# Altium schematic sheet Power.SchDoc: Power Supplies, Battery Charger & Switch
size A2; Revision: 1.0; SheetNumber: 4; SheetTotal: 5; ENG_APP_DATE: --/--/--; DSN_APP_DATE: --/--/--; CHK_APP_DATE: --/--/--
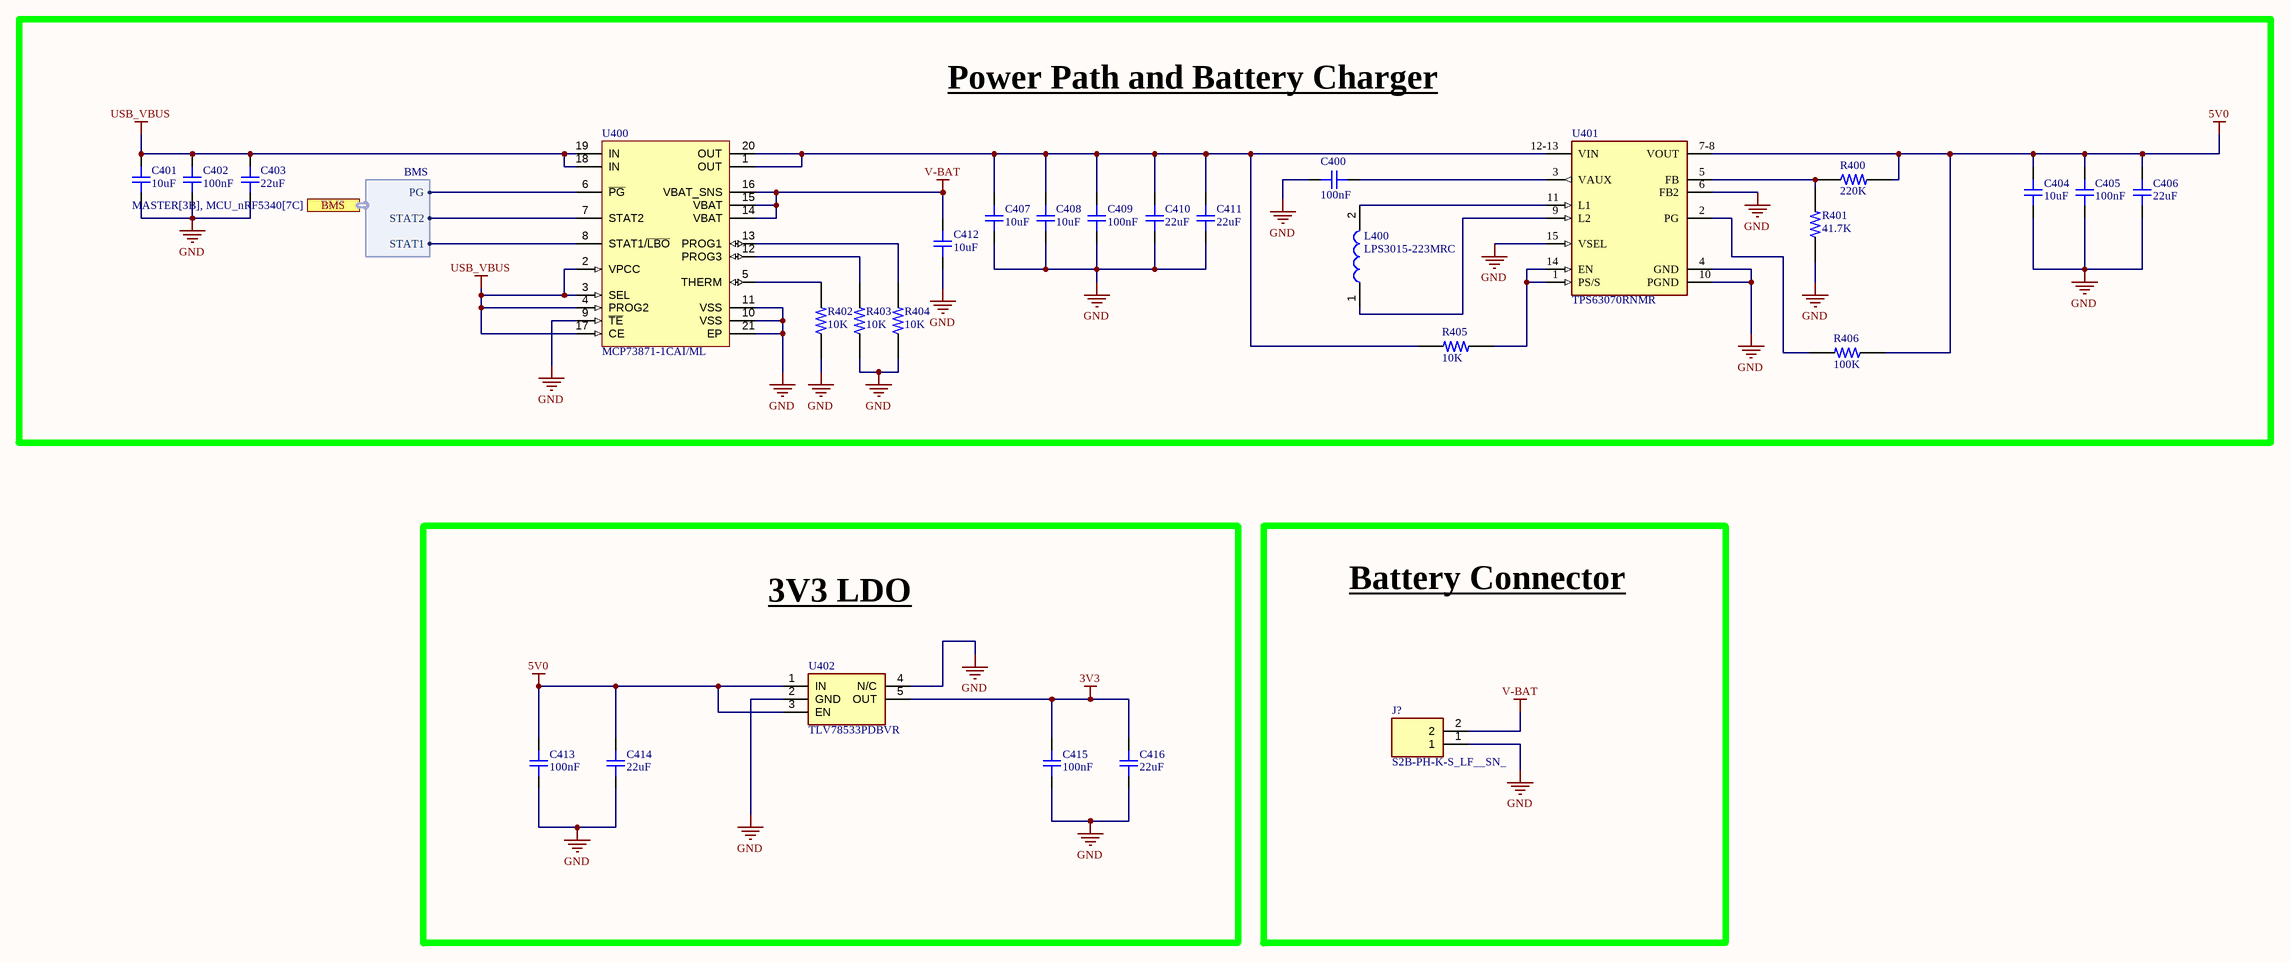
[diagram p0: Power.SchDoc]

## Parts
C400  100nF  [CAP_0603]
C401  10uF  [CAP_0603]
C402  100nF  [CAP_0603]
C403  22uF  [CAP_0603]
C404  10uF  [CAP_0603]
C405  100nF  [CAP_0603]
C406  22uF  [CAP_0603]
C407  10uF  [CAP_0603]
C408  10uF  [CAP_0603]
C409  100nF  [CAP_0603]
C410  22uF  [CAP_0603]
C411  22uF  [CAP_0603]
C412  10uF  [CAP_0603]
C413  100nF  [CAP_0603]
C414  22uF  [CAP_0603]
C415  100nF  [CAP_0603]
C416  22uF  [CAP_0603]
J?  S2B-PH-K-S_LF__SN_  [SHDRRA2W50P0X200_1X2_590X760X480P]
L400  LPS3015-223MRC  [FP-LPS3015-MFG]
R400  220K  [RESC1607X60N]
R401  41.7K  [RESC1607X60N]
R402  10K  [RESC1607X60N]
R403  10K  [RESC1607X60N]
R404  10K  [RESC1607X60N]
R405  10K  [RESC1607X60N]
R406  100K  [RESC1607X60N]
U400  MCP73871-1CAI/ML  [QFN-ML20_M]
U401  TPS63070RNMR  [FP-RNM0015A-MFG]
U402  TLV78533PDBVR  [SOT-23-5]

## Blocks framed on the sheet
Power Path and Battery Charger: C400-C412 L400 R400-R406 U400 U401
3V3 LDO: C413-C416 U402
Battery Connector: J?

## Ports
BMS (harness BMS, see MASTER[3B], MCU_nRF5340[7C])

## Harnesses
BMS: PG, STAT1, STAT2

## Nets
3V3: C415.2 C416.2 U402.5(OUT)
5V0: C404.2 C405.2 C406.2 C413.2 C414.2 R400.2 R406.1 U401.7-8(VOUT) U402.1(IN) U402.3(EN)
GND: C400.2 C401.1 C402.1 C403.1 C404.1 C405.1 C406.1 C407.1 C408.1 C409.1 C410.1 C411.1 C412.1 C413.1 C414.1 C415.1 C416.1 J?.1 R401.1 R402.1 R403.1 R404.1 U400.9(~{TE}) U400.10(VSS) U400.11(VSS) U400.21(EP) U401.4(GND) U401.6(FB2) U401.10(PGND) U401.15(VSEL) U402.2(GND) U402.4(N/C)
USB_VBUS: C401.2 C402.2 C403.2 U400.2(VPCC) U400.3(SEL) U400.4(PROG2) U400.17(CE) U400.18(IN) U400.19(IN)
V-BAT: C412.2 J?.2 U400.14(VBAT) U400.15(VBAT) U400.16(VBAT_SNS)
NetC400_1: C400.1 U401.3(VAUX)
NetC407_2: C407.2 C408.2 C409.2 C410.2 C411.2 R405.2 U400.1(OUT) U400.20(OUT) U401.12-13(VIN)
NetL400_1: L400.1 U401.9(L2)
NetL400_2: L400.2 U401.11(L1)
NetR400_1: R400.1 R401.2 U401.5(FB)
NetR402_2: R402.2 U400.5(THERM)
NetR403_2: R403.2 U400.12(PROG3)
NetR404_2: R404.2 U400.13(PROG1)
NetR405_1: R405.1 U401.1(PS/S) U401.14(EN)
NetR406_2: R406.2 U401.2(PG)
NetU400_6: U400.6(~{PG}) ; port BMS.PG
NetU400_7: U400.7(STAT2) ; port BMS.STAT2
NetU400_8: U400.8(STAT1/~{LBO}) ; port BMS.STAT1

## Notes on the sheet
- DWG. NO.
- REV.
- SHT.
- THIS DOCUMENT AND THE DATA DISCLOSED HEREIN OR HEREWITH IS THE PROPERTY OF ALTIUM LIMITED AND MAY BE FREELY DISTRIBUTED IN WHOLE. NO RIGHTS ARE RESERVED OR EXPRESS OR IMPLIED WARANTEE GIVEN.
- REVISION
- DESCRIPTION
- DATE
- APPROVED
- ENG:
- APPROVALS
- PROJECT
- DSN:
- CHK:
- REFERENCE DOCUMENTS
- PROJECT REVISION:
- TITLE
- DOCUMENT REVISION:
- DESIGN ITEM:
- BOM:
- FAB DWG:
- PCB DWG:
- ASSY DWG:
- SCALE:
- SIZE
- B
- CAGE CODE
- FILE NAME
- DWG NO.
- SHEET
- OF
- REV

## Library data of the parts
C400 C402 C405 C409 C413 C415 = CAP_0603: Multilayer Ceramic Capacitors MLCC, 0.1 uF, 10 %, 0603, 50V, X7R, TR; Manufacturer: *; Manufacturer Part Number: *; Distributor Link: *; LCSC: *; Rating: *; Dielectric: *; Supplier: Future Electronics; Supplier Part Number: 2183445; RoHS: Compliant; Category: Ceramic Capacitors; Stock: 3000; Pricing: 3000=0.0115, 9000=0.0112, 30000=0.0109, 60000=0.0108, 120000=0.0105 (USD); Value: 100nF; Dielectric Material: Ceramic; Lifecycle Status: Production; Max Operating Temperature: 125°C; Min Operating Temperature: -55°C; Mounting Technology: Surface Mount; Number of Terminals: 2; REACH SVHC: Yes; Voltage Rating (DC): 50V; ComponentLink1URL: https://datasheet.octopart.com:443/MAJCU168BB7104KTEA01-Taiyo-Yuden-datasheet-182113548.pdf?src-supplier=IHS; ComponentLink1Description: https://datasheet.octopart.com:443/MAJCU168BB7104KTEA01-Taiyo-Yuden-datasheet-182113548.pdf?src-supplier=IHS
C401 C404 C407 C408 C412 = CAP_0603: Ceramic Capacitor, Multilayer, Ceramic, 4V, 20% +Tol, 20% -Tol, X6S, 22% TC, 10uF, Surface Mount, 1608M/0603; Value: 10µF; Manufacturer: *; Manufacturer Part Number: *; Distributor Link: *; LCSC: *; Rating: *; Dielectric: *; Supplier: Mouser; Supplier Part Number: 81-GXT188C80G106ME3D; RoHS: Compliant; Category: Ceramic Capacitors; Stock: 3027; Pricing: 1=0.31, 10=0.202, 50=0.202, 100=0.115, 1000=0.082, 10000=0.063 (USD); Case/Package: 0603; Dielectric Material: Ceramic; Height: 800µm; Length: 1.6mm; Lifecycle Status: Production; Material: Ceramic; Max Operating Temperature: 105°C; Min Operating Temperature: -55°C; Mounting Technology: Surface Mount; Number of Terminals: 2; REACH SVHC: Yes; Tolerance: 20%; Voltage Rating: 4V; Voltage Rating (DC): 4V; Width: 800µm; ComponentLink1URL: http://sigma.octopart.com:80/reach_statement/Murata-company-16.pdf?src-supplier=Compliance+Statements; ComponentLink1Description: http://sigma.octopart.com:80/reach_statement/Murata-company-16.pdf?src-supplier=Compliance+Statements
C403 C406 C410 C411 C414 C416 = CAP_0603: Ceramic Capacitor, Multilayer, Ceramic, 6.3V, 20% +Tol, 20% -Tol, X6S, 22uF, Surface Mount, 1608M/0603; Value: 22µF; Manufacturer: *; Manufacturer Part Number: *; Distributor Link: *; LCSC: *; Rating: *; Dielectric: *; Supplier: Mouser; Supplier Part Number: 81-GRM188C80J226ME1D; RoHS: Compliant; Category: Ceramic Capacitors; Stock: 5675; Pricing: 1=0.3, 1=0.258, 10=0.195, 10=0.168, 50=0.195, 100=0.112, 100=0.096, 500=0.077, 1000=0.082, 1000=0.071, 2000=0.065, 4000=0.057, 8000=0.053, 10000=0.062, 24000=0.052 (USD); Case/Package: 0603; Dielectric Material: Ceramic; Height: 800µm; Length: 1.6mm; Lifecycle Status: Production; Material: Ceramic; Max Operating Temperature: 105°C; Min Operating Temperature: -55°C; Mounting Technology: Surface Mount; Number of Terminals: 2; REACH SVHC: Yes; Thickness: 800µm; Tolerance: 20%; Voltage Rating: 6.3V; Voltage Rating (DC): 6.3V; Width: 800µm; ComponentLink1URL: https://datasheet.octopart.com:443/GRM188C80J226ME01D-Murata-datasheet-165579666.pdf?src-supplier=TME; ComponentLink1Description: https://datasheet.octopart.com:443/GRM188C80J226ME01D-Murata-datasheet-165579666.pdf?src-supplier=TME; ComponentLink2URL: https://datasheet.octopart.com/GRM188C80J226ME01D-Murata-datasheet-12515295.pdf; ComponentLink2Description: https://datasheet.octopart.com/GRM188C80J226ME01D-Murata-datasheet-12515295.pdf; ComponentLink3URL: https://datasheet.octopart.com/GRM188C80J226ME01D-Murata-datasheet-12510076.pdf; ComponentLink3Description: https://datasheet.octopart.com/GRM188C80J226ME01D-Murata-datasheet-12510076.pdf; ComponentLink4URL: https://datasheet.octopart.com/GRM188C80J226ME01D-Murata-datasheet-11978611.pdf; ComponentLink4Description: https://datasheet.octopart.com/GRM188C80J226ME01D-Murata-datasheet-11978611.pdf; ComponentLink5URL: https://datasheet.octopart.com/GRM188C80J226ME01D-Murata-datasheet-10025737.pdf; ComponentLink5Description: https://datasheet.octopart.com/GRM188C80J226ME01D-Murata-datasheet-10025737.pdf; ComponentLink6URL: https://datasheet.octopart.com/GRM188C80J226ME01D-Murata-datasheet-8819587.pdf; ComponentLink6Description: https://datasheet.octopart.com/GRM188C80J226ME01D-Murata-datasheet-8819587.pdf; ComponentLink7URL: http://sigma.octopart.com:80/reach_statement/Murata-company-16.pdf?src-supplier=Compliance+Statements; ComponentLink7Description: http://sigma.octopart.com:80/reach_statement/Murata-company-16.pdf?src-supplier=Compliance+Statements
J? = S2B-PH-K-S_LF__SN_: PH-2.0mm Header side entry 2 way JST PH Series, Series Number S2B, 2mm Pitch 2 Way 1 Row Right Angle PCB Header, Through Hole Termination, 2A; Manufacturer_Name: JST (JAPAN SOLDERLESS TERMINALS); Manufacturer_Part_Number: S2B-PH-K-S(LF)(SN); Geometry.Height: 4.8mm; Mouser Part Number: 306-S2BPHKSLFSNPP; Mouser Price/Stock: https://www.mouser.co.uk/ProductDetail/JST-Commercial/S2B-PH-K-SLFSN?qs=cdbOS8ANM9A5Ie4gXeMjTA%3D%3D; Datasheet Link: *
L400 = LPS3015-223MRC: Inductor; Manufacturer_Name: COILCRAFT; Datasheet Link: https://www.digikey.com/en/products/detail/coilcraft/LPS3015-223MRC/12714657; Height: 1.5mm; Manufacturer_Part_Number: LPS3015-223MRC; Mouser Part Number: 994-LPS3015-223MRC; Mouser Price/Stock: https://www.mouser.co.uk/ProductDetail/Coilcraft/LPS3015-223MRC?qs=QQJxVsr8EGYLL9xIR9QoZA%3D%3D
R400 = RC0603JR0710KL: Res Thick Film 0603 220K Ohm 1% 1/10W ±100ppm/°C Molded SMD SMD Paper Tape on Plastic Reel; Manufacturer: Bourns; Manufacturer Part Number: CR0603-FX-2203ELF; MF: Yageo; Max Power Dissipation: 100mW; Voltage Rating: 75V; Voltage Rating (DC): 50V; SnapEDA_Link: https://www.snapeda.com/parts/RC0603JR0710KL/Yageo/view-part/?ref=snap; Package: 0603 Yageo; Value: *; MP: RC0603JR0710KL; Check_prices: https://www.snapeda.com/parts/RC0603JR0710KL/Yageo/view-part/?ref=eda; Supplier: RS; Supplier Part Number: 458582; RoHS: Compliant; Category: Chip SMD Resistors; Stock: 14800; Pricing: 10=0.004 (EUR); Case/Package: 0603; Case Code (Imperial): 0603; Case Code (Metric): 1608; China RoHS: Non-Compliant; Composition: Thick Film; Contact Plating: Tin; Features: Moisture Resistant; Height: 450µm; Length: 1.6002mm; Lifecycle Status: Production; Max Operating Temperature: 155°C; Min Operating Temperature: -55°C; Mounting Technology: Surface Mount; Number of Terminals: 2; Number of Terminations: 2; Power Dissipation: 100mW; Power Rating: 100mW; Radiation Hardening: No; REACH SVHC: Yes; Schedule B: 8533210045, 8533210045|8533210045, 8533210045|8533210045|8533210045, 8533210045|8533210045|8533210045|8533210045; Temperature Coefficient: 100ppm/°C; Termination: SMD/SMT; Tolerance: 1%; Width: 800µm; Working Voltage: 75V; ComponentLink1URL: https://datasheet.octopart.com:443/CR0603-FX-2203ELF-Bourns-datasheet-159578630.pdf?src-supplier=ODG+(Origin+Data+Global); ComponentLink1Description: https://datasheet.octopart.com:443/CR0603-FX-2203ELF-Bourns-datasheet-159578630.pdf?src-supplier=ODG+(Origin+Data+Global); ComponentLink2URL: https://datasheet.octopart.com:443/CR0603-FX-2203ELF-Bourns-datasheet-181955239.pdf?src-supplier=IHS; ComponentLink2Description: https://datasheet.octopart.com:443/CR0603-FX-2203ELF-Bourns-datasheet-181955239.pdf?src-supplier=IHS; ComponentLink3URL: https://datasheet.octopart.com:443/CR0603-FX-2203ELF-Bourns-datasheet-68301634.pdf?src-supplier=Burklin+Elektronik; ComponentLink3Description: https://datasheet.octopart.com:443/CR0603-FX-2203ELF-Bourns-datasheet-68301634.pdf?src-supplier=Burklin+Elektronik; ComponentLink4URL: https://datasheet.octopart.com:443/CR0603-FX-2203ELF-Bourns-datasheet-49799764.pdf?src-supplier=Newark; ComponentLink4Description: https://datasheet.octopart.com:443/CR0603-FX-2203ELF-Bourns-datasheet-49799764.pdf?src-supplier=Newark; ComponentLink5URL: https://datasheet.octopart.com:443/CR0603-FX-2203ELF-Bourns-datasheet-154729663.pdf?src-supplier=Electro+Sonic; ComponentLink5Description: https://datasheet.octopart.com:443/CR0603-FX-2203ELF-Bourns-datasheet-154729663.pdf?src-supplier=Electro+Sonic; ComponentLink6URL: https://datasheet.octopart.com/CR0603-FX-2203ELF-Bourns-datasheet-5318152.pdf; ComponentLink6Description: https://datasheet.octopart.com/CR0603-FX-2203ELF-Bourns-datasheet-5318152.pdf; ComponentLink7URL: https://datasheet.octopart.com:443/CR0603-FX-2203ELF-Bourns-datasheet-137066215.pdf?src-supplier=X-ON; ComponentLink7Description: https://datasheet.octopart.com:443/CR0603-FX-2203ELF-Bourns-datasheet-137066215.pdf?src-supplier=X-ON; ComponentLink8URL: https://datasheet.octopart.com:443/CR0603-FX-2203ELF-Bourns-datasheet-140567134.pdf?src-supplier=Arrow.cn; ComponentLink8Description: https://datasheet.octopart.com:443/CR0603-FX-2203ELF-Bourns-datasheet-140567134.pdf?src-supplier=Arrow.cn; ComponentLink9URL: http://sigma.octopart.com:80/conflict_mineral_statement/Bourns-company-36.pdf?src-supplier=Compliance+Statements; ComponentLink9Description: http://sigma.octopart.com:80/conflict_mineral_statement/Bourns-company-36.pdf?src-supplier=Compliance+Statements
R401 = RC0603JR0710KL: Res Thin Film 0402 41.7K Ohm 0.1% 1/16W 25ppm/C Molded SMD SMD Paper T/R; Manufacturer: Vishay; Manufacturer Part Number: TNPW040241K7BEED; MF: Yageo; Max Power Dissipation: 63mW; Temperature Coefficient: 25ppm/°C; Working Voltage: 50V; SnapEDA_Link: https://www.snapeda.com/parts/RC0603JR0710KL/Yageo/view-part/?ref=snap; Package: 0603 Yageo; Value: *; MP: RC0603JR0710KL; Check_prices: https://www.snapeda.com/parts/RC0603JR0710KL/Yageo/view-part/?ref=eda; Supplier: Farnell; Supplier Part Number: 3975618RL; RoHS: Compliant; Category: Chip SMD Resistors; Stock: 4910; Pricing: 100=0.15, 500=0.128, 2500=0.127, 5000=0.118, 10000=0.0988 (EUR); Case/Package: 0402; China RoHS: Compliant; Composition: Thin Film; Contact Plating: Tin; Features: Anti-Sulfur, Automotive AEC-Q200, Moisture Resistant; Height: 350µm; Length: 990.6µm; Lifecycle Status: Production; Max Operating Temperature: 125°C; Min Operating Temperature: -55°C; Mounting Technology: Surface Mount; Number of Terminals: 2; Number of Terminations: 2; Power Dissipation: 63mW; Power Rating: 63mW; REACH SVHC: Yes; Tolerance: 0.1%; Width: 500µm; ComponentLink1URL: https://datasheet.octopart.com:443/TNPW040241K7BEED-Vishay-datasheet-182188515.pdf?src-supplier=IHS; ComponentLink1Description: https://datasheet.octopart.com:443/TNPW040241K7BEED-Vishay-datasheet-182188515.pdf?src-supplier=IHS; ComponentLink2URL: https://datasheet.octopart.com:443/TNPW040241K7BEED-Vishay-Dale-datasheet-182026744.pdf?src-supplier=IHS; ComponentLink2Description: https://datasheet.octopart.com:443/TNPW040241K7BEED-Vishay-Dale-datasheet-182026744.pdf?src-supplier=IHS; ComponentLink3URL: https://datasheet.octopart.com/TNPW040241K7BEED-Vishay-datasheet-13498837.pdf; ComponentLink3Description: https://datasheet.octopart.com/TNPW040241K7BEED-Vishay-datasheet-13498837.pdf; ComponentLink4URL: https://datasheet.octopart.com/TNPW040241K7BEED-Vishay-datasheet-13414878.pdf; ComponentLink4Description: https://datasheet.octopart.com/TNPW040241K7BEED-Vishay-datasheet-13414878.pdf; ComponentLink5URL: https://datasheet.octopart.com/TNPW040241K7BEED-Vishay-datasheet-13295955.pdf; ComponentLink5Description: https://datasheet.octopart.com/TNPW040241K7BEED-Vishay-datasheet-13295955.pdf; ComponentLink6URL: https://datasheet.octopart.com/TNPW040241K7BEED-Vishay-datasheet-13196373.pdf; ComponentLink6Description: https://datasheet.octopart.com/TNPW040241K7BEED-Vishay-datasheet-13196373.pdf; ComponentLink7URL: https://datasheet.octopart.com/TNPW040241K7BEED-Vishay-datasheet-13143890.pdf; ComponentLink7Description: https://datasheet.octopart.com/TNPW040241K7BEED-Vishay-datasheet-13143890.pdf; ComponentLink8URL: https://datasheet.octopart.com/TNPW040241K7BEED-Vishay-datasheet-13081780.pdf; ComponentLink8Description: https://datasheet.octopart.com/TNPW040241K7BEED-Vishay-datasheet-13081780.pdf; ComponentLink9URL: https://datasheet.octopart.com/TNPW040241K7BEED-Vishay-datasheet-13052401.pdf; ComponentLink9Description: https://datasheet.octopart.com/TNPW040241K7BEED-Vishay-datasheet-13052401.pdf; ComponentLink10URL: https://datasheet.octopart.com/TNPW040241K7BEED-Vishay-datasheet-13034137.pdf; ComponentLink10Description: https://datasheet.octopart.com/TNPW040241K7BEED-Vishay-datasheet-13034137.pdf; ComponentLink11URL: https://datasheet.octopart.com/TNPW040241K7BEED-Vishay-datasheet-12585086.pdf; ComponentLink11Description: https://datasheet.octopart.com/TNPW040241K7BEED-Vishay-datasheet-12585086.pdf; ComponentLink12URL: https://datasheet.octopart.com/TNPW040241K7BEED-Vishay-datasheet-12543131.pdf; ComponentLink12Description: https://datasheet.octopart.com/TNPW040241K7BEED-Vishay-datasheet-12543131.pdf; ComponentLink13URL: https://datasheet.octopart.com/TNPW040241K7BEED-Vishay-datasheet-12532511.pdf; ComponentLink13Description: https://datasheet.octopart.com/TNPW040241K7BEED-Vishay-datasheet-12532511.pdf; ComponentLink14URL: https://datasheet.octopart.com/TNPW040241K7BEED-Vishay-datasheet-12519971.pdf; ComponentLink14Description: https://datasheet.octopart.com/TNPW040241K7BEED-Vishay-datasheet-12519971.pdf; ComponentLink15URL: https://datasheet.octopart.com/TNPW040241K7BEED-Vishay-datasheet-12509767.pdf; ComponentLink15Description: https://datasheet.octopart.com/TNPW040241K7BEED-Vishay-datasheet-12509767.pdf; ComponentLink16URL: https://datasheet.octopart.com/TNPW040241K7BEED-Vishay-datasheet-12365287.pdf; ComponentLink16Description: https://datasheet.octopart.com/TNPW040241K7BEED-Vishay-datasheet-12365287.pdf; ComponentLink17URL: https://datasheet.octopart.com/TNPW040241K7BEED-Vishay-datasheet-10854096.pdf; ComponentLink17Description: https://datasheet.octopart.com/TNPW040241K7BEED-Vishay-datasheet-10854096.pdf; ComponentLink18URL: https://datasheet.octopart.com/TNPW040241K7BEED-Vishay-datasheet-10678752.pdf; ComponentLink18Description: https://datasheet.octopart.com/TNPW040241K7BEED-Vishay-datasheet-10678752.pdf; ComponentLink19URL: https://datasheet.octopart.com/TNPW040241K7BEED-Vishay-datasheet-10283461.pdf; ComponentLink19Description: https://datasheet.octopart.com/TNPW040241K7BEED-Vishay-datasheet-10283461.pdf; ComponentLink20URL: https://datasheet.octopart.com/TNPW040241K7BEED-Vishay-datasheet-10185418.pdf; ComponentLink20Description: https://datasheet.octopart.com/TNPW040241K7BEED-Vishay-datasheet-10185418.pdf; ComponentLink21URL: https://datasheet.octopart.com/TNPW040241K7BEED-Vishay-datasheet-10055244.pdf; ComponentLink21Description: https://datasheet.octopart.com/TNPW040241K7BEED-Vishay-datasheet-10055244.pdf; ComponentLink22URL: http://sigma.octopart.com:80/rohs_statement/Vishay-company-15.pdf?src-supplier=Compliance+Statements; ComponentLink22Description: http://sigma.octopart.com:80/rohs_statement/Vishay-company-15.pdf?src-supplier=Compliance+Statements
R402-R405 = RC0603JR0710KL: 10 kOhms ±5% 0.1W Chip Resistor 0603 Anti-Sulfur AEC-Q200 Thick Film; Manufacturer: Vishay; Manufacturer Part Number: RCA060310K0JNEA; MF: Yageo; Max Power Dissipation: 100mW; Temperature Coefficient: 200ppm/°C; Working Voltage: 75V; SnapEDA_Link: https://www.snapeda.com/parts/RC0603JR0710KL/Yageo/view-part/?ref=snap; Package: 0603 Yageo; Value: *; MP: RC0603JR0710KL; Check_prices: https://www.snapeda.com/parts/RC0603JR0710KL/Yageo/view-part/?ref=eda; Supplier: Arrow Electronics; Supplier Part Number: RCA060310K0JNEA; RoHS: Compliant; Category: Chip SMD Resistors; Stock: 2572; Pricing: 1=0.018, 10=0.005, 25=0.005, 100=0.004, 250=0.004, 500=0.004, 1000=0.004 (USD); Case/Package: 0603; Case Code (Imperial): 0603; Case Code (Metric): 1608; China RoHS: Non-Compliant; Composition: Thick Film; Contact Plating: Tin; Features: Anti-Sulfur, Automotive AEC-Q200; Height: 450µm; Length: 1.5494mm; Lifecycle Status: Production; Max Operating Temperature: 155°C; Min Operating Temperature: -55°C; Mounting Technology: Surface Mount; Number of Terminals: 2; Number of Terminations: 2; Power Dissipation: 100mW; Radiation Hardening: No; REACH SVHC: Yes; Schedule B: 8533210045, 8533210045|8533210045|8533210045|8533210045|8533210045; Tolerance: 5%; Width: 850µm; ComponentLink1URL: https://datasheet.octopart.com:443/RCA060310K0JNEA-Vishay-datasheet-181963188.pdf?src-supplier=IHS; ComponentLink1Description: https://datasheet.octopart.com:443/RCA060310K0JNEA-Vishay-datasheet-181963188.pdf?src-supplier=IHS; ComponentLink2URL: https://datasheet.octopart.com:443/RCA060310K0JNEA-Vishay-datasheet-188933149.pdf?src-supplier=TME; ComponentLink2Description: https://datasheet.octopart.com:443/RCA060310K0JNEA-Vishay-datasheet-188933149.pdf?src-supplier=TME; ComponentLink3URL: https://datasheet.octopart.com:443/RCA060310K0JNEA-Vishay-datasheet-12588632.pdf?src-supplier=Future+Electronics; ComponentLink3Description: https://datasheet.octopart.com:443/RCA060310K0JNEA-Vishay-datasheet-12588632.pdf?src-supplier=Future+Electronics; ComponentLink4URL: https://datasheet.octopart.com:443/RCA060310K0JNEA-Vishay-datasheet-12542284.pdf?src-supplier=Future+Electronics; ComponentLink4Description: https://datasheet.octopart.com:443/RCA060310K0JNEA-Vishay-datasheet-12542284.pdf?src-supplier=Future+Electronics; ComponentLink5URL: https://datasheet.octopart.com:443/RCA060310K0JNEA-Vishay-datasheet-12535775.pdf?src-supplier=Future+Electronics; ComponentLink5Description: https://datasheet.octopart.com:443/RCA060310K0JNEA-Vishay-datasheet-12535775.pdf?src-supplier=Future+Electronics; ComponentLink6URL: https://datasheet.octopart.com:443/RCA060310K0JNEA-Vishay-datasheet-12509930.pdf?src-supplier=Future+Electronics; ComponentLink6Description: https://datasheet.octopart.com:443/RCA060310K0JNEA-Vishay-datasheet-12509930.pdf?src-supplier=Future+Electronics; ComponentLink7URL: https://datasheet.octopart.com:443/RCA060310K0JNEA-Vishay-datasheet-5392162.pdf?src-supplier=Future+Electronics; ComponentLink7Description: https://datasheet.octopart.com:443/RCA060310K0JNEA-Vishay-datasheet-5392162.pdf?src-supplier=Future+Electronics; ComponentLink8URL: http://sigma.octopart.com:80/rohs_statement/Vishay-company-15.pdf?src-supplier=Compliance+Statements; ComponentLink8Description: http://sigma.octopart.com:80/rohs_statement/Vishay-company-15.pdf?src-supplier=Compliance+Statements
R406 = RC0603JR0710KL: Resistor Chip Thick Film 100k Ohm 1% 1/10W ±100ppm/°K Molded T/R; Manufacturer: Vishay; Manufacturer Part Number: CRCW0603100KFKED; MF: Yageo; Power Dissipation: 100mW; Temperature Coefficient: 100ppm/°C; Working Voltage: 75V; SnapEDA_Link: https://www.snapeda.com/parts/RC0603JR0710KL/Yageo/view-part/?ref=snap; Package: 0603 Yageo; Value: *; MP: RC0603JR0710KL; Check_prices: https://www.snapeda.com/parts/RC0603JR0710KL/Yageo/view-part/?ref=eda; Supplier: Mouser; Supplier Part Number: 71-CRCW0603100KFKED; RoHS: Compliant; Category: Chip SMD Resistors; Stock: 39690; Pricing: 1=0.12, 10=0.033, 50=0.033, 100=0.016, 1000=0.010, 10000=0.005 (USD); Case/Package: 0603; China RoHS: Non-Compliant; Height: 450µm; Lead Free: Lead Free; Lifecycle Status: Production; Max Operating Temperature: 155°C; Min Operating Temperature: -55°C; Mounting Technology: Surface Mount; Number of Terminals: 2; Power Rating: 100mW; REACH SVHC: Yes; Tolerance: 1%; Width: 850µm; ComponentLink1URL: https://datasheet.octopart.com:443/CRCW0603100KFKED-Vishay-datasheet-175423584.pdf?src-supplier=IHS; ComponentLink1Description: https://datasheet.octopart.com:443/CRCW0603100KFKED-Vishay-datasheet-175423584.pdf?src-supplier=IHS; ComponentLink2URL: http://sigma.octopart.com:80/rohs_statement/Vishay-company-15.pdf?src-supplier=Compliance+Statements; ComponentLink2Description: http://sigma.octopart.com:80/rohs_statement/Vishay-company-15.pdf?src-supplier=Compliance+Statements
U400 = MCP73871-1CAI/ML: EAR99 MCP73871 Matte Tin (Sn) Tube battery charger 5.35V 1.1A 0.5mm -40C~85C TA; Manufacturer: Microchip; Output Voltage: 4.1V; DatasheetVersion: revB, May-2009; PackageReference: QFN-ML20; PackageDescription: 20-Lead Plastic Quad Flat, No Lead Package (ML) - 4x4x0.9 mm Body [QFN]; PackageVersion: revBB, Aug-2009; Supplier: DigiKey; Supplier Part Number: MCP73871-1CAI/ML-ND; Manufacturer Part Number: MCP73871-1CAI/ML; Category: Battery Management; Stock: 47; Pricing: 1=2.08, 25=1.736 (EUR); Projected EOL Date: 2034-07-17; Case/Package: QFN; Country of Assembly: Malaysia, Thailand; Country of Fabrication: United States of America; Country of Origin: Malaysia, Thailand; Export Control Classification Number (ECCN) Code: EAR99; Harmonized Tariff Schedule (HTS) Code: 8542.39.0060; Introduction Date: 2008-07-17; Lifecycle Status: Production; Pins: 20; RoHS: Non-Compliant; ComponentLink1URL: https://datasheet.octopart.com/MCP73871-1CAI/ML-Microchip-datasheet-11053087.pdf; ComponentLink1Description: https://datasheet.octopart.com/MCP73871-1CAI/ML-Microchip-datasheet-11053087.pdf; ComponentLink2URL: https://datasheet.octopart.com:443/MCP73871-1CAI-ML-Microchip-datasheet-175858736.pdf?src-supplier=Microchip; ComponentLink2Description: https://datasheet.octopart.com:443/MCP73871-1CAI-ML-Microchip-datasheet-175858736.pdf?src-supplier=Microchip; ComponentLink3URL: https://datasheet.octopart.com:443/MCP73871-1CAI-ML-Microchip-datasheet-137252038.pdf?src-supplier=Electro+Sonic; ComponentLink3Description: https://datasheet.octopart.com:443/MCP73871-1CAI-ML-Microchip-datasheet-137252038.pdf?src-supplier=Electro+Sonic; ComponentLink4URL: https://datasheet.octopart.com:443/MCP73871-1CAI-ML-Microchip-datasheet-159005942.pdf?src-supplier=SHENGYU+ELECTRONICS; ComponentLink4Description: https://datasheet.octopart.com:443/MCP73871-1CAI-ML-Microchip-datasheet-159005942.pdf?src-supplier=SHENGYU+ELECTRONICS; ComponentLink5URL: https://datasheet.octopart.com:443/MCP73871-1CAI-ML-Microchip-datasheet-142675560.pdf?src-supplier=TME; ComponentLink5Description: https://datasheet.octopart.com:443/MCP73871-1CAI-ML-Microchip-datasheet-142675560.pdf?src-supplier=TME; ComponentLink6URL: https://datasheet.octopart.com:443/MCP73871-1CAI-ML-Microchip-datasheet-24910595.pdf?src-supplier=TME; ComponentLink6Description: https://datasheet.octopart.com:443/MCP73871-1CAI-ML-Microchip-datasheet-24910595.pdf?src-supplier=TME; ComponentLink7URL: http://sigma.octopart.com:80/188450168/materials_sheet/Microchip-MCP73871-1CAI-ML.pdf?src-supplier=Compliance+Statements; ComponentLink7Description: http://sigma.octopart.com:80/188450168/materials_sheet/Microchip-MCP73871-1CAI-ML.pdf?src-supplier=Compliance+Statements; ComponentLink8URL: http://sigma.octopart.com:80/conflict_mineral_statement/Microchip-company-68.pdf?src-supplier=Compliance+Statements; ComponentLink8Description: http://sigma.octopart.com:80/conflict_mineral_statement/Microchip-company-68.pdf?src-supplier=Compliance+Statements; ComponentLink9URL: http://sigma.octopart.com:80/conflict_mineral_statement/Microchip-company-69.pdf?src-supplier=Compliance+Statements; ComponentLink9Description: http://sigma.octopart.com:80/conflict_mineral_statement/Microchip-company-69.pdf?src-supplier=Compliance+Statements; ComponentLink10URL: http://sigma.octopart.com:80/reach_statement/Microchip-company-70.pdf?src-supplier=Compliance+Statements; ComponentLink10Description: http://sigma.octopart.com:80/reach_statement/Microchip-company-70.pdf?src-supplier=Compliance+Statements; ComponentLink11URL: http://sigma.octopart.com:80/rohs_statement/Microchip-company-71.pdf?src-supplier=Compliance+Statements; ComponentLink11Description: http://sigma.octopart.com:80/rohs_statement/Microchip-company-71.pdf?src-supplier=Compliance+Statements
U401 = TPS63070RNMR: IC REG BCK BST ADJ 3.6A 15VQFN; Manufacturer: Texas Instruments; Manufacturer Lifecycle Status: ACTIVE; Synchronous Rectifier: Yes; Output Type: Adjustable; Output Current: 2A; Max Input Voltage: 16V; Switching Frequency: 2.4MHz; Min Output Voltage: 2.5V; Output Configuration: Positive; Min Input Voltage: 2V; Topology: Buck-Boost; Number of Outputs: 1; Max Output Voltage: 9V; Quiescent Current: 50uA; Max Duty Cycle: 100%; Max Junction Temperature (Tj): 125°C; Max Operating Temperature: 125°C; Case/Package: VQFN; Number of Pins: 15; RoHS Compliant: Yes; Mount: Surface Mount; Min Operating Temperature: -40°C; Lead Free: Lead Free; Packaging: Tape and Reel; Supplier: Arrow Electronics; Supplier Part Number: TPS63070RNMR; Manufacturer Part Number: TPS63070RNMR; RoHS: Compliant; Category: Voltage Regulators - Switching; Stock: 1476; Pricing: 1=2.422, 10=1.968, 25=1.817, 100=1.658, 250=1.574, 500=1.518, 1000=1.403 (USD); Height: 1mm; Length: 3mm; Lifecycle Status: Production; Max Supply Voltage: 16V; Min Supply Voltage: 2V; Mounting Technology: Surface Mount; Pins: 15; Output Voltage: 2.5V; Schedule B: 8542390000, 8542390000|8542390000|8542390000|8542390000|8542390000; Thickness: 900µm; Width: 2.5mm; ComponentLink1URL: https://octopart.com:443/opatz8j6/c1?t=dhCZltYoo_UkPhesAZpvIZTz42jcjPYjzQrmXWuK15fI5KXqnKRrCL9KEBmr3IM6HD6YioQCFSPZfMXUDn0Vme1fr8oLJBsEBqmfs6yA0YjUz45d92W7eQYxzyF0vQVmkJOzV0l4D_EdjPxUZjJu4yz2Xnc4SBK04Rs7bqL42RcAKvJ0PJ9O_C_MfxyWmIK4NBcIiDYVjqBirsiLe-Hdw51UiXTXIN-O1wh9-QM-wbFH3PtY_kSaA31dqItJyAV3A_ATfrsLiODg4tBU0CxYGHeOm2X6r0KwYAL2nGtRZ9XlUYfaFH4zewqVjxAOzj2dIQPGWdHUhWeodas115gv1OIeLKNtKl-2xOwkJz88MQ1Vr-SJnmZIWTmdn1jarGObcJfwIAJ_&src-supplier=Texas+Instruments; ComponentLink1Description: https://octopart.com:443/opatz8j6/c1?t=dhCZltYoo_UkPhesAZpvIZTz42jcjPYjzQrmXWuK15fI5KXqnKRrCL9KEBmr3IM6HD6YioQCFSPZfMXUDn0Vme1fr8oLJBsEBqmfs6yA0YjUz45d92W7eQYxzyF0vQVmkJOzV0l4D_EdjPxUZjJu4yz2Xnc4SBK04Rs7bqL42RcAKvJ0PJ9O_C_MfxyWmIK4NBcIiDYVjqBirsiLe-Hdw51UiXTXIN-O1wh9-QM-wbFH3PtY_kSaA31dqItJyAV3A_ATfrsLiODg4tBU0CxYGHeOm2X6r0KwYAL2nGtRZ9XlUYfaFH4zewqVjxAOzj2dIQPGWdHUhWeodas115gv1OIeLKNtKl-2xOwkJz88MQ1Vr-SJnmZIWTmdn1jarGObcJfwIAJ_&src-supplier=Texas+Instruments; ComponentLink2URL: https://datasheet.octopart.com:443/TPS63070RNMR-Texas-Instruments-datasheet-99731598.pdf?src-supplier=Newark; ComponentLink2Description: https://datasheet.octopart.com:443/TPS63070RNMR-Texas-Instruments-datasheet-99731598.pdf?src-supplier=Newark; ComponentLink3URL: https://datasheet.octopart.com:443/TPS63070RNMR-Texas-Instruments-datasheet-159118225.pdf?src-supplier=LCSC; ComponentLink3Description: https://datasheet.octopart.com:443/TPS63070RNMR-Texas-Instruments-datasheet-159118225.pdf?src-supplier=LCSC; ComponentLink4URL: https://datasheet.octopart.com:443/TPS63070RNMR-Texas-Instruments-datasheet-140571939.pdf?src-supplier=Arrow.cn; ComponentLink4Description: https://datasheet.octopart.com:443/TPS63070RNMR-Texas-Instruments-datasheet-140571939.pdf?src-supplier=Arrow.cn; ComponentLink5URL: http://sigma.octopart.com:80/conflict_mineral_statement/Texas-Instruments-company-63.pdf?src-supplier=Compliance+Statements; ComponentLink5Description: http://sigma.octopart.com:80/conflict_mineral_statement/Texas-Instruments-company-63.pdf?src-supplier=Compliance+Statements; ComponentLink6URL: http://sigma.octopart.com:80/reach_statement/Texas-Instruments-company-64.pdf?src-supplier=Compliance+Statements; ComponentLink6Description: http://sigma.octopart.com:80/reach_statement/Texas-Instruments-company-64.pdf?src-supplier=Compliance+Statements
U402 = TLV78533PDBVR: Linear Voltage Regulator IC Positive Fixed 1 Output 500mA SOT-23-5; Manufacturer_Name: Texas Instruments; Geometry.Height: 1.45mm; Mouser Part Number: *; Mouser Price/Stock: *; Manufacturer_Part_Number: TLV78533PDBVR; Datasheet Link: https://www.ti.com/lit/ds/symlink/tlv785.pdf?ts=1763721349650&ref_url=https%253A%252F%252Fwww.ti.com%252Fproduct%252FTLV785%252Fpart-details%252FTLV78533PDBVR